# EAGLE design santiago (EAGLE 5.08)

## Sheet 1 of 3
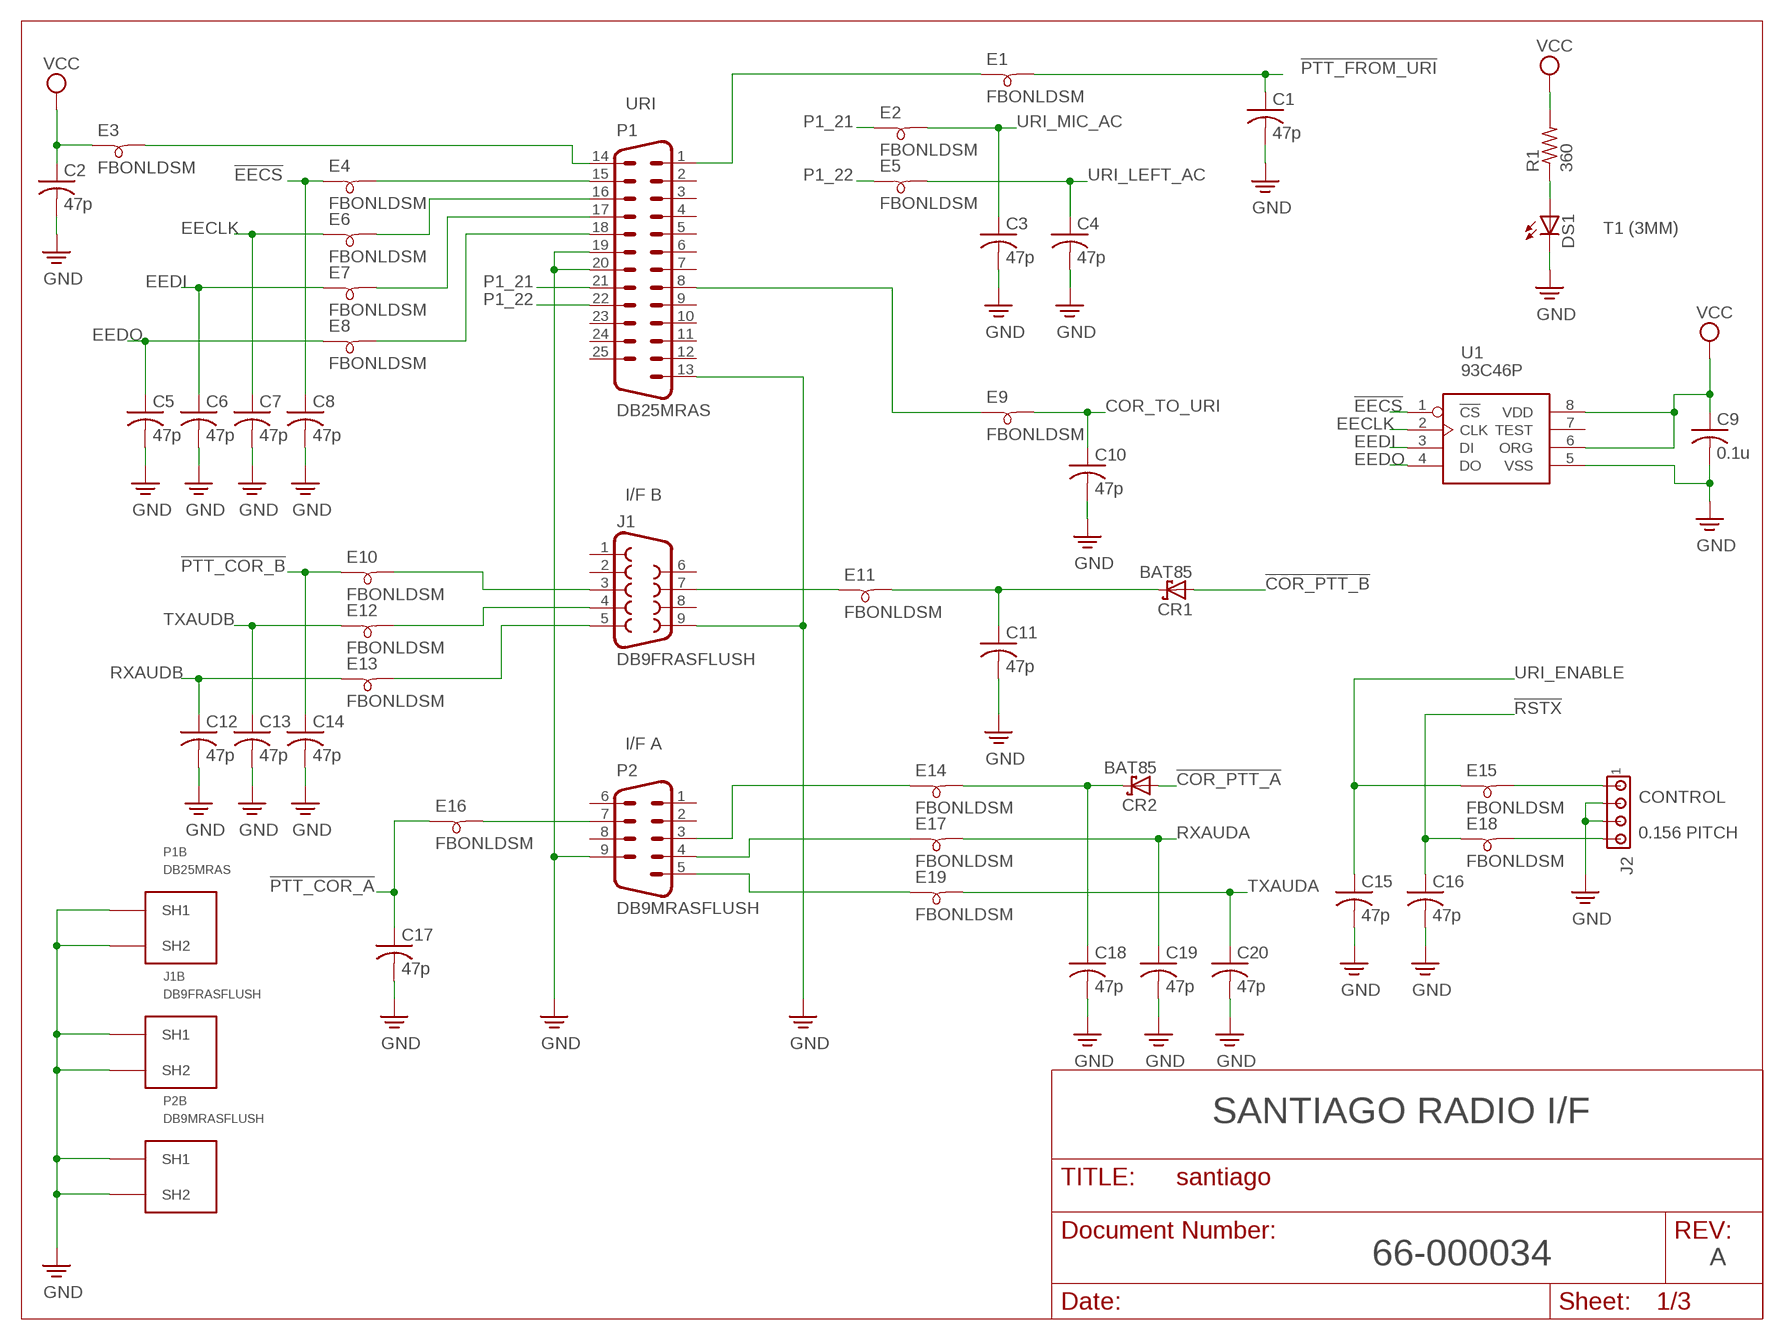
[diagram p0: schematic, sheet 1]

### Parts
C1  47p  C-US025-030X050  [C025-030X050]
C2  47p  C-US025-030X050  [C025-030X050]
C3  47p  C-US025-030X050  [C025-030X050]
C4  47p  C-US025-030X050  [C025-030X050]
C5  47p  C-US025-030X050  [C025-030X050]
C6  47p  C-US025-030X050  [C025-030X050]
C7  47p  C-US025-030X050  [C025-030X050]
C8  47p  C-US025-030X050  [C025-030X050]
C9  0.1u  C-US025-030X050  [C025-030X050]
C10  47p  C-US025-030X050  [C025-030X050]
C11  47p  C-US025-030X050  [C025-030X050]
C12  47p  C-US025-030X050  [C025-030X050]
C13  47p  C-US025-030X050  [C025-030X050]
C14  47p  C-US025-030X050  [C025-030X050]
C15  47p  C-US025-030X050  [C025-030X050]
C16  47p  C-US025-030X050  [C025-030X050]
C17  47p  C-US025-030X050  [C025-030X050]
C18  47p  C-US025-030X050  [C025-030X050]
C19  47p  C-US025-030X050  [C025-030X050]
C20  47p  C-US025-030X050  [C025-030X050]
CR1  BAT85  [DO34-7]
CR2  BAT85  [DO34-7]
DS1  LED3MM  [LED3MM]
E1  FBONLDSM  [FBONLEADSSMALL]
E2  FBONLDSM  [FBONLEADSSMALL]
E3  FBONLDSM  [FBONLEADSSMALL]
E4  FBONLDSM  [FBONLEADSSMALL]
E5  FBONLDSM  [FBONLEADSSMALL]
E6  FBONLDSM  [FBONLEADSSMALL]
E7  FBONLDSM  [FBONLEADSSMALL]
E8  FBONLDSM  [FBONLEADSSMALL]
E9  FBONLDSM  [FBONLEADSSMALL]
E10  FBONLDSM  [FBONLEADSSMALL]
E11  FBONLDSM  [FBONLEADSSMALL]
E12  FBONLDSM  [FBONLEADSSMALL]
E13  FBONLDSM  [FBONLEADSSMALL]
E14  FBONLDSM  [FBONLEADSSMALL]
E15  FBONLDSM  [FBONLEADSSMALL]
E16  FBONLDSM  [FBONLEADSSMALL]
E17  FBONLDSM  [FBONLEADSSMALL]
E18  FBONLDSM  [FBONLEADSSMALL]
E19  FBONLDSM  [FBONLEADSSMALL]
J1  DB9FRASFLUSH  [DSUB9F]
J2  CONN_MTA156_RA_4P  [1X4MTA156RA]
P1  DB25MRAS  [DSUB25M]
P2  DB9MRASFLUSH  [DSUB9M]
R1  360  R-US_0207/10  [0207/10]
U1  93C46P  [DIL08]

### Nets
!COR_PTT_A: CR2.A ; also sheet 3
!COR_PTT_B: CR1.A ; also sheet 3
!EECS: C8.1 E4.1 U1.1(!CS)
!PTT_COR_A: C17.1 E16.1 ; also sheet 3
!PTT_COR_B: C14.1 E10.1 ; also sheet 3
!PTT_FROM_URI: C1.1 E1.2 ; also sheet 3
!RSTX: C16.1 E18.1 ; also sheet 3
COR_TO_URI: C10.1 E9.2 ; also sheet 3
CORPTTB: C11.1 CR1.C E11.2
EECLK: C7.1 E6.1 U1.2(CLK)
EEDI: C6.1 E7.1 U1.3(DI)
EEDO: C5.1 E8.1 U1.4(DO)
GND: C1.2 C2.2 C3.2 C4.2 C5.2 C6.2 C7.2 C8.2 C9.2 C10.2 C11.2 C12.2 C13.2 C14.2 C15.2 C16.2 C17.2 C18.2 C19.2 C20.2 DS1.K(C) J1.9 J1.SHELL1(SH1) J1.SHELL2(SH2) J2.2 J2.3 P1.13 P1.19 P1.20 P1.SHELL1(SH1) P1.SHELL2(SH2) P2.9 P2.G1(SH1) P2.G2(SH2) U1.5(VSS) ; also sheet 2,3
N$8: E1.1 P1.1
N$9 [power]: E3.2 P1.14
N$11: E9.1 P1.8
N$12: E4.2 P1.15
N$13: E6.2 P1.16
N$14: E7.2 P1.17
N$15: E8.2 P1.18
N$16: E14.1 P2.3
N$17: E13.2 J1.5
N$18: E12.2 J1.4
N$19: E10.2 J1.3
N$20: E11.1 J1.7
N$21: E17.1 P2.4
N$22: E19.1 P2.5
N$25: C18.1 CR2.C E14.2
N$26: E16.2 P2.7
N$28: DS1.A R1.1
N$32: E18.2 J2.4
N$33: E15.2 J2.1
P1_21: E2.1 P1.21
P1_22: E5.1 P1.22
RXAUDA: C19.1 E17.2 ; also sheet 2
RXAUDB: C12.1 E13.1 ; also sheet 2
TXAUDA: C20.1 E19.2 ; also sheet 2
TXAUDB: C13.1 E12.1 ; also sheet 2
URI_ENABLE: C15.1 E15.1 ; also sheet 2,3
URI_LEFT_AC: C4.1 E5.2 ; also sheet 2
URI_MIC_AC: C3.1 E2.2 ; also sheet 2
VCC [power]: C2.1 C9.1 E3.1 R1.2 U1.6(ORG) U1.8(VDD) ; also sheet 2,3
Unconnected: J1.1 J1.2 J1.6 J1.8 P1.2 P1.3 P1.4 P1.5 P1.6 P1.7 P1.9 P1.10 P1.11 P1.12 P1.23 P1.24 P1.25 P2.1 P2.2 P2.6 P2.8 U1.7(TEST)

### Notes on the sheet
- URI
- T1 (3MM)
- I/F B
- I/F A
- CONTROL
- 0.156 PITCH
- SANTIAGO RADIO I/F
- 66-000034 | A

## Sheet 2 of 3
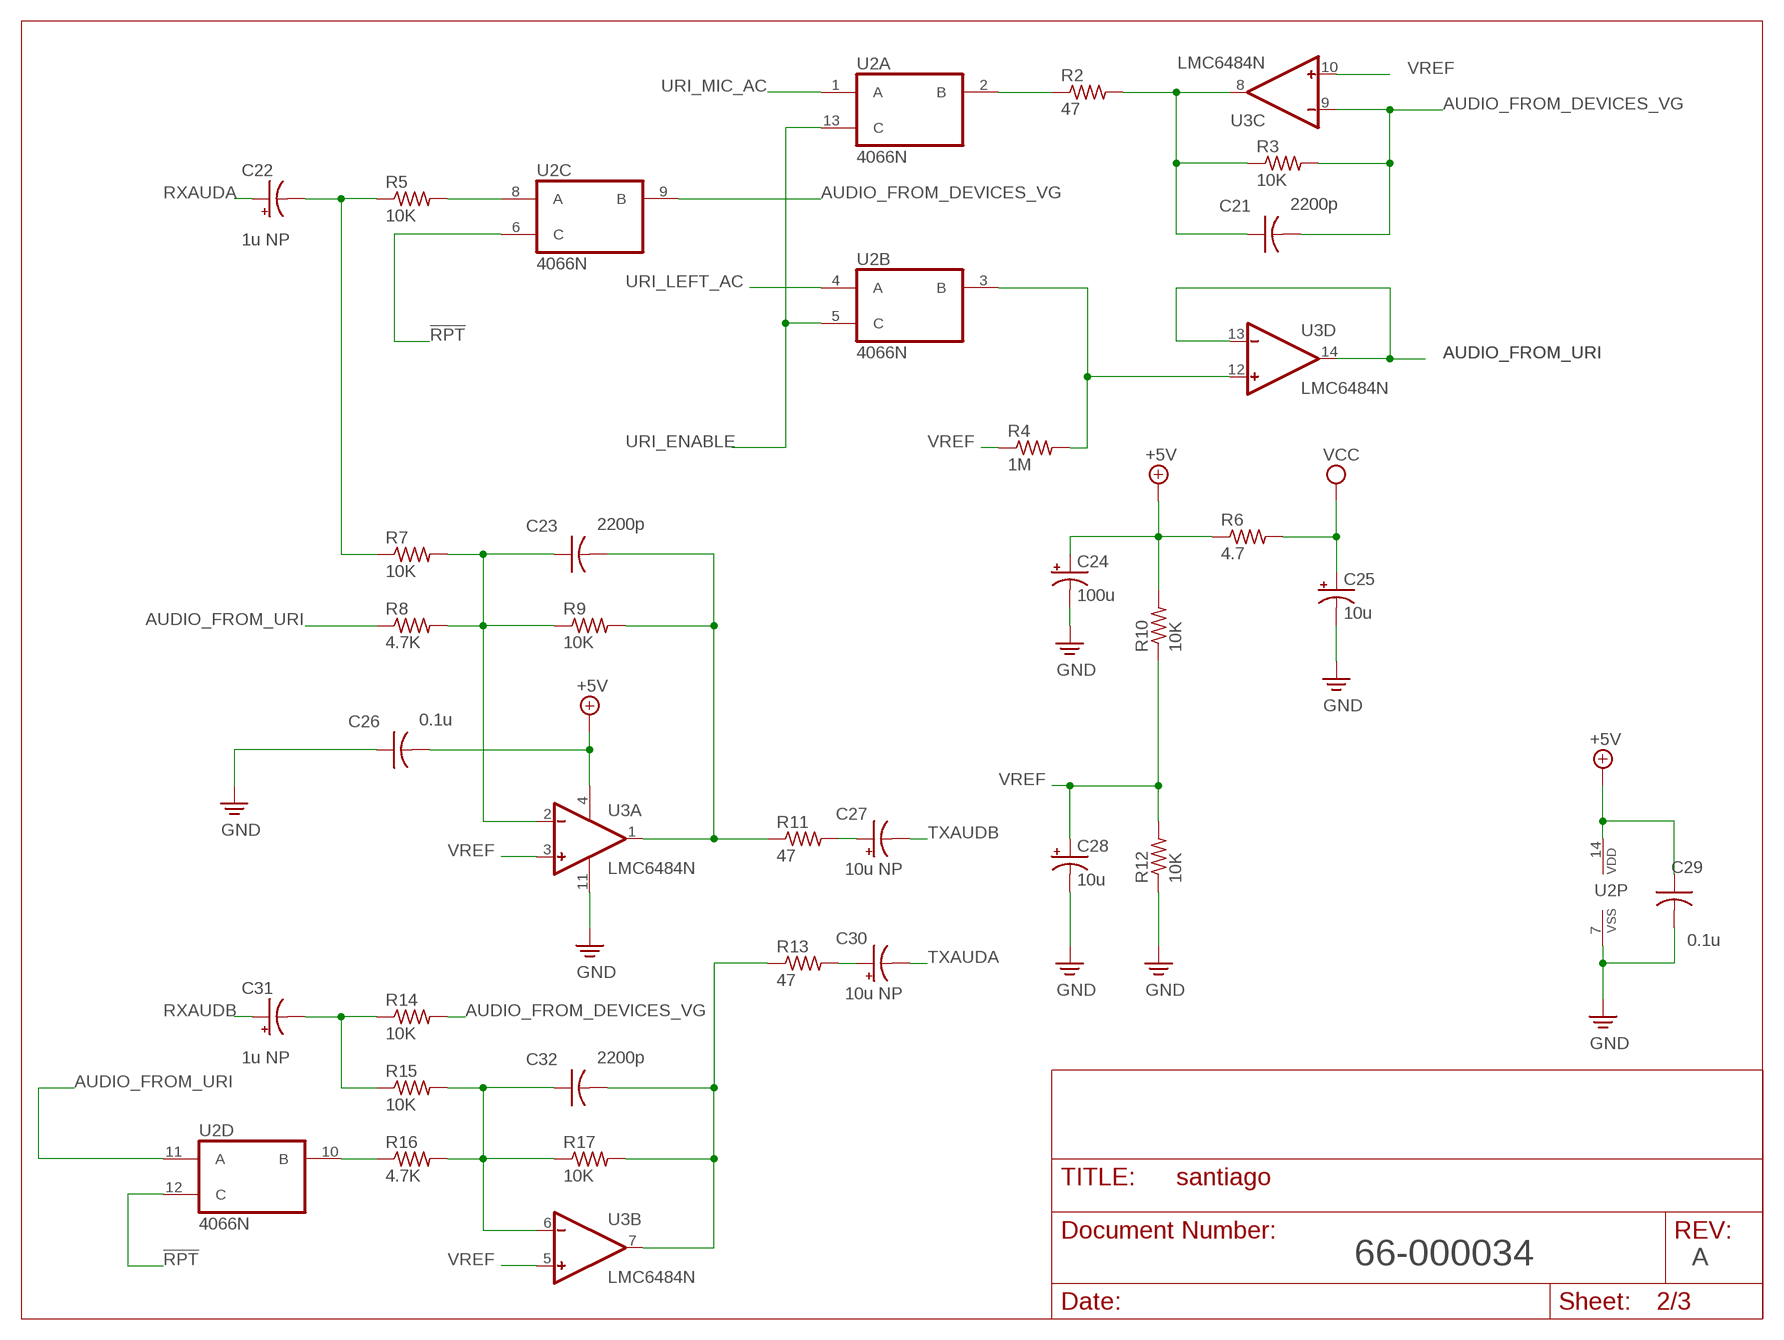
[diagram p1: schematic, sheet 2]

### Parts
C21  2200p  C-US025-030X050  [C025-030X050]
C22  1u NP  CPOL-USE2-5  [E2-5]
C23  2200p  C-US025-030X050  [C025-030X050]
C24  100u  CPOL-USE2.5-7  [E2,5-7]
C25  10u  CPOL-USE2-5  [E2-5]
C26  0.1u  C-US025-030X050  [C025-030X050]
C27  10u NP  CPOL-USE2.5-7  [E2,5-7]
C28  10u  CPOL-USE2-5  [E2-5]
C29  0.1u  C-US025-030X050  [C025-030X050]
C30  10u NP  CPOL-USE2.5-7  [E2,5-7]
C31  1u NP  CPOL-USE2-5  [E2-5]
C32  2200p  C-US025-030X050  [C025-030X050]
R2  47  R-US_0207/10  [0207/10]
R3  10K  R-US_0207/10  [0207/10]
R4  1M  R-US_0207/10  [0207/10]
R5  10K  R-US_0207/10  [0207/10]
R6  4.7  R-US_0207/10  [0207/10]
R7  10K  R-US_0207/10  [0207/10]
R8  4.7K  R-US_0207/10  [0207/10]
R9  10K  R-US_0207/10  [0207/10]
R10  10K  R-US_0207/10  [0207/10]
R11  47  R-US_0207/10  [0207/10]
R12  10K  R-US_0207/10  [0207/10]
R13  47  R-US_0207/10  [0207/10]
R14  10K  R-US_0207/10  [0207/10]
R15  10K  R-US_0207/10  [0207/10]
R16  4.7K  R-US_0207/10  [0207/10]
R17  10K  R-US_0207/10  [0207/10]
U2  4066N  [DIL14]
U3  LMC6484N  [DIL14]

### Nets
!RPT: U2.6(C:C) U2.12(D:C) ; also sheet 3
+5V [power]: C24.+ C26.2 C29.1 R6.1 R10.2 U2.14(P:VDD) U3.4(P:V+)
AUDIO_FROM_DEVICES_VG: C21.2 R3.2 R14.2 U2.9(C:B) U3.9(C:-IN)
AUDIO_FROM_URI: R8.1 U2.11(D:A) U3.13(D:-IN) U3.14(D:OUT)
GND: C24.- C25.- C26.1 C28.- C29.2 R12.1 U2.7(P:VSS) U3.11(P:V-) ; also sheet 1,3
N$1: R2.1 U2.2(A:B)
N$2: C21.1 R2.2 R3.1 U3.8(C:OUT)
N$3: C23.2 R9.2 R11.1 U3.1(A:OUT)
N$4: C23.1 R7.2 R8.2 R9.1 U3.2(A:-IN)
N$5: R4.2 U2.3(B:B) U3.12(D:+IN)
N$6: C32.2 R13.1 R17.2 U3.7(B:OUT)
N$7: C32.1 R15.2 R16.2 R17.1 U3.6(B:-IN)
N$10: C27.+ R11.2
N$23: C30.+ R13.2
N$24: C22.- R5.1 R7.1
N$27: C31.- R14.1 R15.1
N$34: R5.2 U2.8(C:A)
N$42: R16.1 U2.10(D:B)
RXAUDA: C22.+ ; also sheet 1
RXAUDB: C31.+ ; also sheet 1
TXAUDA: C30.- ; also sheet 1
TXAUDB: C27.- ; also sheet 1
URI_ENABLE: U2.5(B:C) U2.13(A:C) ; also sheet 1,3
URI_LEFT_AC: U2.4(B:A) ; also sheet 1
URI_MIC_AC: U2.1(A:A) ; also sheet 1
VCC [power]: C25.+ R6.2 ; also sheet 1,3
VREF: C28.+ R4.1 R10.1 R12.2 U3.3(A:+IN) U3.5(B:+IN) U3.10(C:+IN)

### Notes on the sheet
- 66-000034 | A

## Sheet 3 of 3
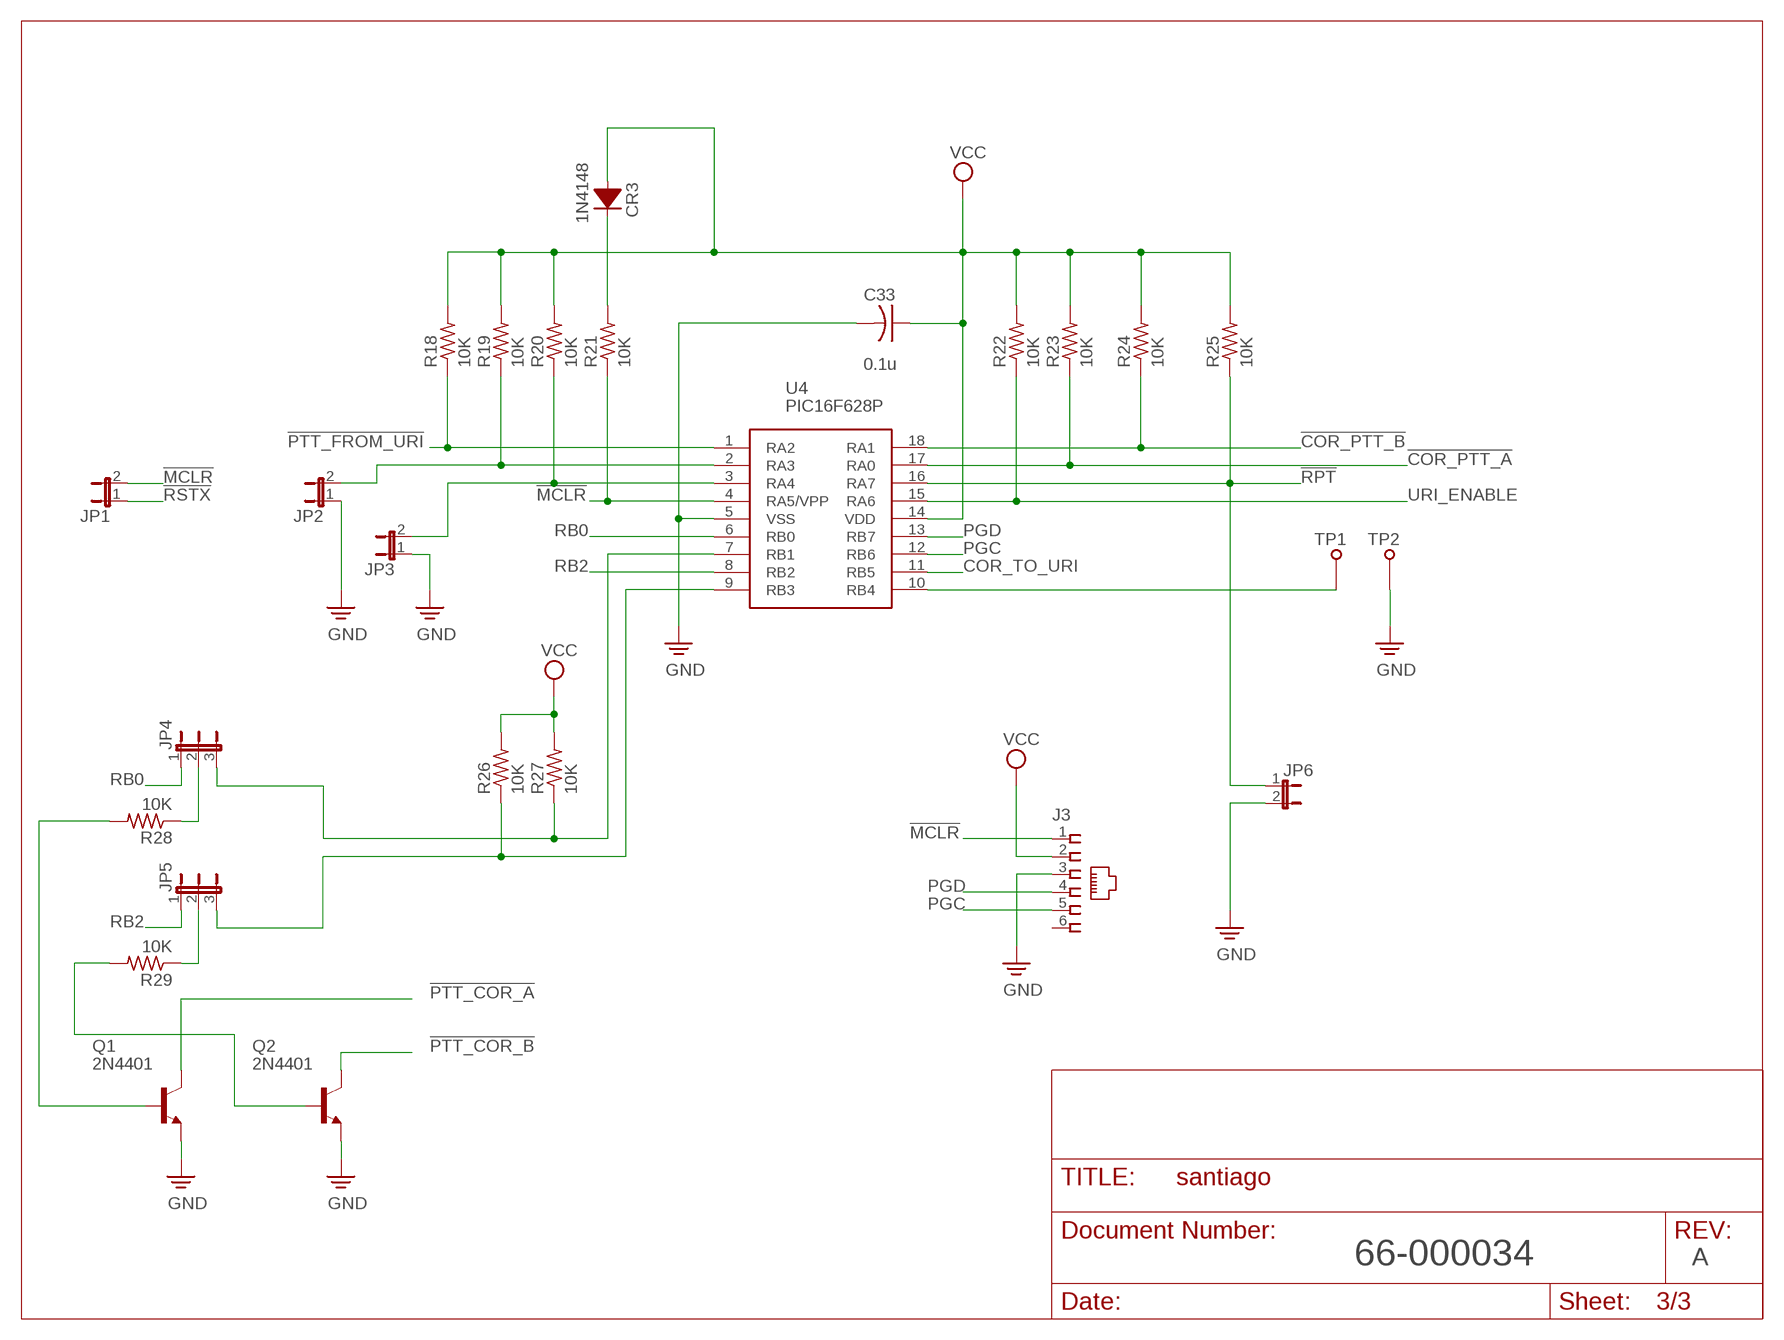
[diagram p2: schematic, sheet 3]

### Parts
C33  0.1u  C-US025-030X050  [C025-030X050]
CR3  1N4148  [DO35-10]
J3  520258-3  [520258-3]
JP1  JP1E  [JP1]
JP2  JP1E  [JP1]
JP3  JP1E  [JP1]
JP4  JP2E  [JP2]
JP5  JP2E  [JP2]
JP6  JP1E  [JP1]
Q1  2N4401  [TO92]
Q2  2N4401  [TO92]
R18  10K  R-US_0207/10  [0207/10]
R19  10K  R-US_0207/10  [0207/10]
R20  10K  R-US_0207/10  [0207/10]
R21  10K  R-US_0207/10  [0207/10]
R22  10K  R-US_0207/10  [0207/10]
R23  10K  R-US_0207/10  [0207/10]
R24  10K  R-US_0207/10  [0207/10]
R25  10K  R-US_0207/10  [0207/10]
R26  10K  R-US_0207/10  [0207/10]
R27  10K  R-US_0207/10  [0207/10]
R28  10K  R-US_0207/10  [0207/10]
R29  10K  R-US_0207/10  [0207/10]
TP1  TESTPINTPSQ025  [TESTPIN]
TP2  TESTPINTPSQ025  [TESTPIN]
U4  PIC16F628P  [DIL18]

### Nets
!COR_PTT_A: R23.1 U4.17(RA0) ; also sheet 1
!COR_PTT_B: R24.1 U4.18(RA1) ; also sheet 1
!MCLR: J3.1 JP1.2 R21.1 U4.4(RA5/VPP)
!PTT_COR_A: Q1.1(C) ; also sheet 1
!PTT_COR_B: Q2.1(C) ; also sheet 1
!PTT_FROM_URI: R18.1 U4.1(RA2) ; also sheet 1
!RPT: JP6.1 R25.1 U4.16(RA7) ; also sheet 2
!RSTX: JP1.1 ; also sheet 1
COR_TO_URI: U4.11(RB5) ; also sheet 1
GND: C33.2 J3.3 JP2.1 JP3.1 JP6.2 Q1.3(E) Q2.3(E) TP2.TP U4.5(VSS) ; also sheet 1,2
N$29: CR3.K R21.2
N$30: JP5.3 R26.1 U4.9(RB3)
N$31: JP4.3 R27.1 U4.7(RB1)
N$35: JP3.2 R20.1 U4.3(RA4)
N$36: JP2.2 R19.1 U4.2(RA3)
N$37: JP4.2 R28.1
N$38: JP5.2 R29.1
N$39: Q1.2(B) R28.2
N$40: Q2.2(B) R29.2
N$41: TP1.TP U4.10(RB4)
PGC: J3.5 U4.12(RB6)
PGD: J3.4 U4.13(RB7)
RB0: JP4.1 U4.6(RB0)
RB2: JP5.1 U4.8(RB2)
URI_ENABLE: R22.1 U4.15(RA6) ; also sheet 1,2
VCC [power]: C33.1 CR3.A J3.2 R18.2 R19.2 R20.2 R22.2 R23.2 R24.2 R25.2 R26.2 R27.2 U4.14(VDD) ; also sheet 1,2
Unconnected: J3.6

### Notes on the sheet
- 66-000034 | A

## Library data of the parts
C1-C21 C23 C26 C29 C32 C33 = rcl:C-US: CAPACITOR, American symbol
C22 C24 C25 C27 C28 C30 C31 = rcl:CPOL-US: POLARIZED CAPACITOR, American symbol
CR1 CR2 = custom:BAT85: BAT85 Schottky Diode 7mm DO-34
CR3 = qrp:1N4148: General Purpose Switching Diode
DS1 = led:LED: LED OSRAM: - CHIPLED LG R971, LG N971, LY N971, LG Q971, LY Q971, LO R971, LY R971 LH N974, LH R974 LS Q976, LO Q976, LY Q976 LO Q996 - Hyper CHIPLED LW Q18S LB Q993, LB Q99A, LB R99A - SideLED LS A670, LO A670, LY A670, LG A670, LP A670 LB A673, LV A673, LT A673, LW A673 LH A674 LY A675 LS A676, LA A676, LO A676, LY A676, LW A676 LS A679, LY A679, LG A679 - Hyper Micro SIDELED® LS Y876, LA Y876, LO Y876, LY Y876 LT Y87S - SmartLED LW L88C, LW L88S LB L89C, LB L89S, LG L890 LS L89K, LO L89K, LY L89K LS L896, LA L896, LO L896, LY L896 - TOPLED LS T670, LO T670, LY T670, LG T670, LP T670 LSG T670, LSP T670, LSY T670, LOP T670, LYG T670 LG T671, LOG T671, LSG T671 LB T673, LV T673, LT T673, LW T673 LH T674 LS T676, LA T676, LO T676, LY T676, LB T676, LH T676, LSB T676, LW T676 LB T67C, LV T67C, LT T67C, LS T67K, LO T67K, LY T67K, LW E67C LS E67B, LA E67B, LO E67B, LY E67B, LB E67C, LV E67C, LT E67C LW T67C LS T679, LY T679, LG T679 LS T770, LO T770, LY T770, LG T770, LP T770 LB T773, LV T773, LT T773, LW T773 LH T774 LS E675, LA E675, LY E675, LS T675 LS T776, LA T776, LO T776, LY T776, LB T776 LHGB T686 LT T68C, LB T68C - Hyper Mini TOPLED® LB M676 - Mini TOPLED Santana® LG M470 LS M47K, LO M47K, LY M47K Source: http://www.osram.convergy.de LUXEON: - LUMILED® LXK2-PW12-R00, LXK2-PW12-S00, LXK2-PW14-U00, LXK2-PW14-V00 LXK2-PM12-R00, LXK2-PM12-S00, LXK2-PM14-U00 LXK2-PE12-Q00, LXK2-PE12-R00, LXK2-PE12-S00, LXK2-PE14-T00, LXK2-PE14-U00 LXK2-PB12-K00, LXK2-PB12-L00, LXK2-PB12-M00, LXK2-PB14-N00, LXK2-PB14-P00, LXK2-PB14-Q00 LXK2-PR12-L00, LXK2-PR12-M00, LXK2-PR14-Q00, LXK2-PR14-R00 LXK2-PD12-Q00, LXK2-PD12-R00, LXK2-PD12-S00 LXK2-PH12-R00, LXK2-PH12-S00 LXK2-PL12-P00, LXK2-PL12-Q00, LXK2-PL12-R00 Source: www.luxeon.com KINGBRIGHT: KA-3528ASYC Source: www.kingbright.com
E1-E19 = custom:FBONLDSM
J1 = custom:DB9FRAS: DB9 Female Right Angle Connector 0.318
J2 = custom:CONN_MTA156_RA_4P: TYCO MTA .156 Right Angle 4 Pin
J3 = con-amp:520258-3: AMP connector
JP1-JP3 JP6 = jumper:JP1E: JUMPER
JP4 JP5 = jumper:JP2E: JUMPER
P1 = custom:DB25MRAS: DB25 Male Right Angle Short
P2 = custom:DB9MRAS: DB9 Male Right Angle 0.318
Q1 Q2 = custom:2N4401: NPN Transistor
R1 R18-R29 = rcl:R-US_: RESISTOR, American symbol
R2-R17 = resistor:R-US_: RESISTOR, American symbol
TP1 TP2 = custom:TESTPIN: Test pin assortment
U1 = custom:93C46: 93C46 1024 Bit EEPROM DIL08
U2 = 40xx:4066: Quad bilateral ANALOG SWITCH
U3 = custom:LMC6484: OP AMP
U4 = custom:PIC16F628: PIC16F628 DIL18

## Net classes
0 default: width 0.254 mm, drill 0.381 mm, clearance 0.254 mm
1 power: width 0.635 mm, drill 0.762 mm, clearance 0.254 mm

## Board
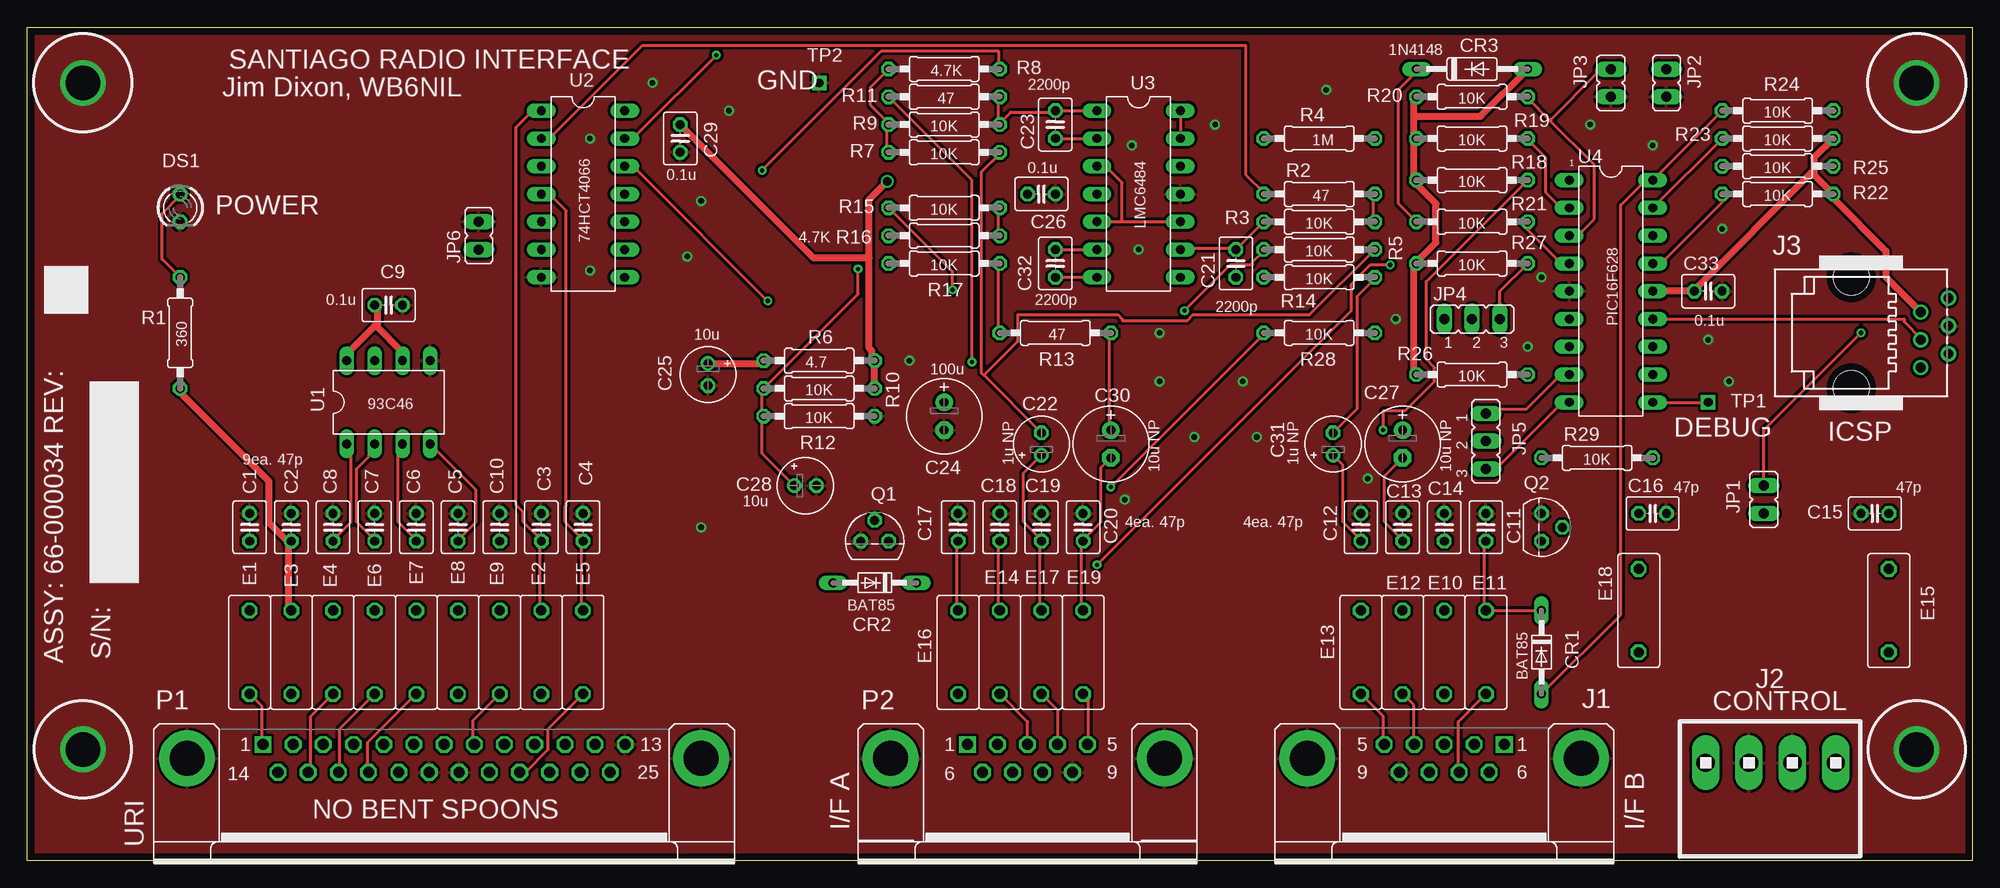
[diagram p3: board, top side]
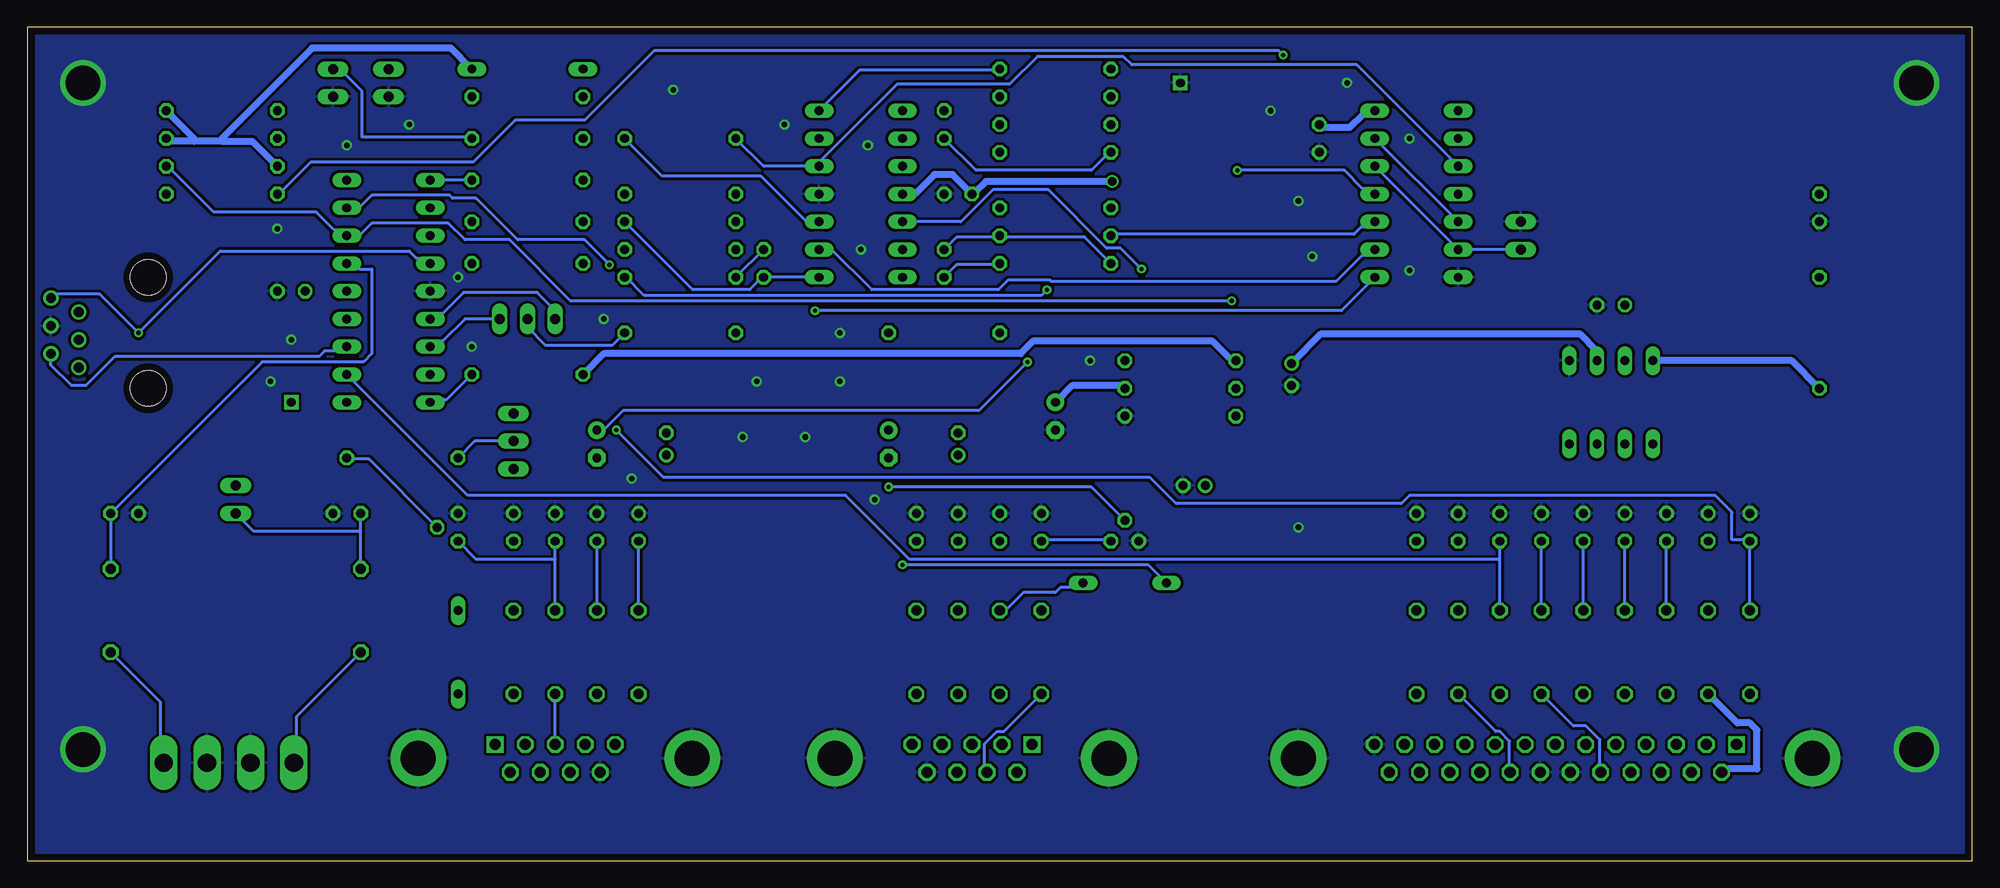
[diagram p4: board, bottom side, seen from below]

Size 177.8 x 76.2 mm. Coordinates in mm from the lower left corner, seen from the top.
Outline: 0,0 0,76.2 177.8,76.2 177.8,0 0,0
Copper layers (1*16): Top 0.035mm / dielectric 1.5mm / Bottom 0.035mm
Design rules "default *": minimum track width 10mil, minimum drill 15mil, track to track 10mil, track to pad 10mil, pad to pad 10mil, via to via 10mil, smd to smd 10mil, copper to edge 25mil, drill to drill 10mil, minimum pad ring 10mil, minimum via ring 8mil, stop-mask expansion 4mil, vias tented up to drill 0mil, thermal gap 10mil

### Footprints (pad centres in the part's own frame; a part is rotated, then mirrored left to right if it is on the bottom)
C025-030X050 = drill 0.813 octagon: 1 -1.27,0; 2 1.27,0
E2-5 = drill 0.813 pad 1.27 round: + -1.016,0 | drill 0.813 pad 1.27 octagon: - 1.016,0
E2,5-7 = drill 0.813 pad 1.6 round: + -1.27,0 | drill 0.813 pad 1.6 octagon: - 1.27,0
DO34-7 = drill 0.813 long: A 3.81,0; C -3.81,0
DO35-10 = drill 0.813 long: A 5.08,0; K -5.08,0
LED3MM = drill 0.813 octagon: A -1.27,0; K 1.27,0
FBONLEADSSMALL = drill 0.914 octagon: 1 -3.81,0; 2 3.81,0
DSUB9F = drill 1.016 square: 1 -5.486,0 | drill 1.016 octagon: 2 -2.743,0; 3 0,0; 4 2.743,0; 5 5.486,0; 6 -4.115,2.54; 7 -1.372,2.54; 8 1.372,2.54; 9 4.115,2.54 | drill 3.175 pad 5.08 round: SHELL1 -12.522,1.27; SHELL2 12.522,1.27
1X4MTA156RA = drill 1.676 long: 1 -5.944,0; 2 -1.981,0; 3 1.981,0; 4 5.944,0
520258-3 = drill 0.889 round: 1 -3.175,8.001; 2 -1.905,5.461; 3 -0.635,8.001; 4 0.635,5.461; 5 1.905,8.001; 6 3.175,5.461 | hole 3.251: -5.08,-0.889; 5.08,-0.889
JP1 = drill 0.914 long: 1 0,-1.27; 2 0,1.27
JP2 = drill 0.914 long: 1 -2.54,0; 2 0,0; 3 2.54,0
DSUB25M = drill 1.016 square: 1 -16.561,10.16 | drill 1.016 octagon: 2 -13.792,10.16; 3 -11.049,10.16; 4 -8.28,10.16; 5 -5.512,10.16; 6 -2.769,10.16; 7 0,10.16; 8 2.769,10.16; 9 5.512,10.16; 10 8.28,10.16; 11 11.049,10.16; 12 13.792,10.16; 13 16.561,10.16; 14 -15.189,7.62; 15 -12.421,7.62; 16 -9.652,7.62; 17 -6.909,7.62; 18 -4.14,7.62; 19 -1.372,7.62; 20 1.372,7.62; 21 4.14,7.62; 22 6.909,7.62; 23 9.652,7.62; 24 12.421,7.62; 25 15.189,7.62 | drill 3.175 pad 5.08 round: SHELL1 -23.495,8.89; SHELL2 23.495,8.89
DSUB9M = drill 1.016 square: 1 -5.486,0 | drill 1.016 octagon: 2 -2.743,0; 3 0,0; 4 2.743,0; 5 5.486,0; 6 -4.115,-2.54; 7 -1.372,-2.54; 8 1.372,-2.54; 9 4.115,-2.54 | drill 3.175 pad 5.08 round: G1 -12.522,-1.27; G2 12.522,-1.27
TO92 = drill 0.813 octagon: 1 1.27,0; 2 0,1.905; 3 -1.27,0
0207/10 = drill 0.813 octagon: 1 -5.08,0; 2 5.08,0
TESTPIN = drill 0.8 square: TP 0,0
DIL08 = drill 0.813 long: 1 -3.81,-3.81; 2 -1.27,-3.81; 3 1.27,-3.81; 4 3.81,-3.81; 5 3.81,3.81; 6 1.27,3.81; 7 -1.27,3.81; 8 -3.81,3.81
DIL14 = drill 0.813 long: 1 -7.62,-3.81; 2 -5.08,-3.81; 3 -2.54,-3.81; 4 0,-3.81; 5 2.54,-3.81; 6 5.08,-3.81; 7 7.62,-3.81; 8 7.62,3.81; 9 5.08,3.81; 10 2.54,3.81; 11 0,3.81; 12 -2.54,3.81; 13 -5.08,3.81; 14 -7.62,3.81
DIL18 = drill 0.813 long: 1 -10.16,-3.81; 2 -7.62,-3.81; 3 -5.08,-3.81; 4 -2.54,-3.81; 5 0,-3.81; 6 2.54,-3.81; 7 5.08,-3.81; 8 7.62,-3.81; 9 10.16,-3.81; 10 10.16,3.81; 11 7.62,3.81; 12 5.08,3.81; 13 2.54,3.81; 14 0,3.81; 15 -2.54,3.81; 16 -5.08,3.81; 17 -7.62,3.81; 18 -10.16,3.81

### Placement (x,y rotation side)
C1  20.32,30.48 90 top
C2  24.13,30.48 90 top
C3  46.99,30.48 90 top
C4  50.8,30.48 90 top
C5  39.37,30.48 90 top
C6  35.56,30.48 90 top
C7  31.75,30.48 90 top
C8  27.94,30.48 90 top
C9  33.02,50.8 0 top
C10  43.18,30.48 90 top
C11  133.35,30.48 90 top
C12  121.92,30.48 90 top
C13  125.73,30.48 90 top
C14  129.54,30.48 90 top
C15  168.91,31.75 180 top
C16  148.59,31.75 0 top
C17  85.09,30.48 90 top
C18  88.9,30.48 90 top
C19  92.71,30.48 90 top
C20  96.52,30.48 90 top
C21  110.49,54.61 90 top
C22  92.71,38.1 90 top
C23  93.98,67.31 90 top
C24  83.82,40.64 270 top
C25  62.23,44.45 270 top
C26  92.71,60.96 180 top
C27  125.73,38.1 270 top
C28  71.12,34.29 0 top
C29  59.69,66.04 270 top
C30  99.06,38.1 270 top
C31  119.38,38.1 90 top
C32  93.98,54.61 270 top
C33  153.67,52.07 0 top
CR1  138.43,19.05 270 top
CR2  77.47,25.4 180 top
CR3  132.08,72.39 0 top
DS1  13.97,59.69 270 top
E1  20.32,19.05 90 top
E2  46.99,19.05 90 top
E3  24.13,19.05 270 top
E4  27.94,19.05 270 top
E5  50.8,19.05 90 top
E6  31.75,19.05 270 top
E7  35.56,19.05 270 top
E8  39.37,19.05 270 top
E9  43.18,19.05 90 top
E10  129.54,19.05 270 top
E11  133.35,19.05 90 top
E12  125.73,19.05 270 top
E13  121.92,19.05 270 top
E14  88.9,19.05 90 top
E15  170.18,22.86 270 top
E16  85.09,19.05 270 top
E17  92.71,19.05 90 top
E18  147.32,22.86 270 top
E19  96.52,19.05 90 top
J1  129.54,10.62 180 top
J2  159.38,8.94 180 top
J3  167.64,48.26 270 top
JP1  158.75,33.02 0 top
JP2  149.86,71.12 0 top
JP3  144.78,71.12 0 top
JP4  132.08,49.53 0 top
JP5  133.35,38.35 270 top
JP6  41.27,57.15 0 top
P1  38.1,0.46 0 top
P2  91.44,10.62 0 top
Q1  77.47,29.21 0 top
Q2  138.43,30.48 270 top
R1  13.97,48.26 270 top
R2  118.11,60.96 0 top
R3  118.11,58.42 180 top
R4  118.11,66.04 180 top
R5  118.11,55.88 180 top
R6  72.39,45.72 180 top
R7  83.82,64.77 180 top
R8  83.82,72.39 180 top
R9  83.82,67.31 0 top
R10  72.39,43.18 0 top
R11  83.82,69.85 180 top
R12  72.39,40.64 180 top
R13  93.98,48.26 0 top
R14  118.11,53.34 180 top
R15  83.82,59.69 0 top
R16  83.82,57.15 0 top
R17  83.82,54.61 0 top
R18  132.08,62.23 180 top
R19  132.08,66.04 180 top
R20  132.08,69.85 180 top
R21  132.08,58.42 180 top
R22  160.02,60.96 0 top
R23  160.02,66.04 0 top
R24  160.02,68.58 0 top
R25  160.02,63.5 180 top
R26  132.08,44.45 180 top
R27  132.08,54.61 180 top
R28  118.11,48.26 180 top
R29  143.51,36.83 0 top
TP1  153.67,41.91 0 top
TP2  72.39,71.12 0 top
U1  33.02,41.91 0 top
U2  50.8,60.96 270 top
U3  101.6,60.96 270 top
U4  144.78,52.07 270 top

### Tracks (layer width: path | path; a pad name or v marks a point on that pad's centre or on a via)
!COR_PTT_A  (via drill 0.38)
  Top 0.254: v97.79,27.05 121.03,50.29 121.03,52.7 122.81,54.48 v124.59,54.48 | U4.17 R23.1
  Bottom 0.254: CR2.A 75.31,27.05 v97.79,27.05 | v124.59,54.48 126.87,56.77 132.97,56.77 136.78,60.58 138.94,60.58 139.19,60.83 146.3,60.83 147.45,59.69 U4.17
!COR_PTT_B
  Top 0.254: CR1.A 145.67,22.48 145.67,59.94 147.96,62.23 U4.18 R24.1
!EECS
  Top 0.254: U1.1 29.59,37.72 29.59,30.99 27.94,29.34 C8.1
  Bottom 0.254: E4.1 C8.1
!MCLR  (via drill 0.38)
  Top 0.254: U4.4 139.83,54.61 139.83,54.99 137.16,57.66 R21.1 | v167.64,48.26 158.75,39.37 JP1.2
  Bottom 0.254: J3.1 175.26,51.82 171.2,51.82 v167.64,48.26 167.64,48.39 167.51,48.39 160.15,55.75 142.88,55.75 142.24,55.12 141.48,55.12 U4.4
!PTT_COR_A
  Top 0.254: E16.1 84.96,22.99 84.96,29.08 C17.1
  Bottom 0.254: Q1.1 78.87,29.34 84.96,29.34 C17.1
!PTT_COR_B
  Bottom 0.254: E10.1 129.54,27.56 | 129.54,27.56 C14.1 | Q2.1 136.78,27.56 129.54,27.56
!PTT_FROM_URI  (via drill 0.38)
  Top 0.254: R18.1 127.89,52.96 127.89,45.85 128.65,45.09 128.65,43.81 125.98,41.15 123.95,41.15 v123.95,39.37
  Bottom 0.254: R18.1 U4.1 | E1.2 C1.1 20.45,29.34 21.97,29.34 21.97,31.88 23.5,33.4 51.44,33.4 52.2,32.64 72.77,32.64 75.18,35.05 119.63,35.05 v123.95,39.37
!RPT  (via drill 0.38)
  Top 0.254: U2.12 55.75,63.5 55.75,63.12 v67.69,51.18
  Bottom 0.254: JP6.1 U2.6 U2.12 | R25.1 164.97,63.5 160.78,59.31 151.38,59.31 149.73,57.66 149.1,57.66 U4.16 148.59,57.28 147.32,57.28 146.3,58.29 139.32,58.29 137.79,56.77 133.73,56.77 128.14,51.18 v67.69,51.18
!RSTX
  Bottom 0.254: E18.1 147.32,30.1 | 147.32,30.1 C16.1 | JP1.1 157.1,30.1 147.32,30.1
+5V  (via drill 0.76)
  Top 0.635: R10.2 R6.1 77.22,45.85 77.22,46.61 76.96,46.86 76.96,55.12 | C29.1 71.88,55.12 76.96,55.12 | v78.61,62.1 76.96,60.45 76.96,55.12
  Bottom 0.635: U3.4 96.65,60.96 94.87,62.74 93.22,62.74 C26.2 91.19,61.09 90.17,62.1 v78.61,62.1 | U2.14 54.86,68.33 55.63,68.33 56.9,67.06 59.31,67.06 59.56,67.31 C29.1 | C24.+ 82.3,43.43 77.85,43.43 77.6,43.18 R10.2
AUDIO_FROM_DEVICES_VG
  Top 0.254: R3.2 C21.2 110.49,56.01 105.41,56.01 U3.9
  Bottom 0.254: C21.2 R14.2 | U2.9 55.12,55.37 55.75,55.37 58.17,52.96 84.2,52.96 84.33,53.09 88.14,53.09 89.03,52.2 100.58,52.2 104.27,55.88 U3.9
AUDIO_FROM_URI  (via drill 0.38)
  Top 0.254: U3.14 U3.13 | v67.18,63.12 78.11,74.04 88.77,74.04 88.77,72.52 R8.1
  Bottom 0.254: U2.11 55.12,61.47 55.75,61.47 57.4,63.12 v67.18,63.12 | U3.14 101.73,72.26 89.03,72.26 R8.1
COR_TO_URI
  Bottom 0.254: E9.2 43.18,27.56 | 43.18,27.56 C10.1 | U4.11 137.54,33.4 103,33.4 97.16,27.56 43.18,27.56
CORPTTB
  Top 0.254: C11.1 133.22,29.08 133.22,22.99 E11.2 CR1.C
EECLK
  Top 0.254: U1.2 31.24,37.59 31.24,36.96 30.1,35.81 30.1,30.99 31.75,29.34 C7.1
  Bottom 0.254: E6.1 C7.1
EEDI
  Top 0.254: U1.3 33.91,37.72 33.91,30.99 35.56,29.34 C6.1
  Bottom 0.254: E7.1 C6.1
EEDO
  Top 0.254: U1.4 41.02,33.91 41.02,30.99 39.37,29.34 C5.1
  Bottom 0.254: E8.1 C5.1
GND  (via drill 0.51, 3.17)
  other vias: 5.08,10.16 5.08,71.12 172.72,71.12 172.72,10.16 80.64,45.72 138.43,53.34 125.09,49.53 137.16,46.99 153.67,47.62 155.57,43.81 154.94,57.78 148.59,65.41 142.88,67.31 118.75,70.48 103.5,43.81 103.5,48.26 106.68,38.73 111.12,43.81 112.39,38.73 100.33,33.02 122.56,34.92 60.33,55.24 61.59,60.33 64.14,68.58 57.15,71.12 51.44,66.04 51.44,53.98 100.97,65.41 101.6,55.88 108.58,67.31 61.59,30.48
  pour Top: 0.64,75.56 177.16,75.56 177.16,0.64 0.64,0.64
  pour Bottom: 0.64,75.56 177.16,75.56 177.16,0.64 0.64,0.64
N$1
  Top 0.254: U2.2 48.13,66.04 48.13,66.42 56.26,74.55 111.38,74.55 111.38,62.74 113.03,61.09 R2.1
N$2
  Top 0.254: R3.1 123.06,58.55 123.06,60.83 R2.2
  Bottom 0.254: U3.8 C21.1 110.62,53.34 111.76,52.2 116.97,52.2 R3.1
N$3
  Top 0.254: R11.1 88.77,69.72 88.77,67.44 R9.2 88.9,67.44 89.92,68.45 93.98,68.45 C23.2 U3.1
N$4
  Top 0.254: C23.1 U3.2 | R7.2 78.61,64.9 78.61,67.18 R9.1 78.61,67.31 78.61,67.56 77.09,69.09 77.09,70.74 R8.2
  Bottom 0.254: C23.1 91.06,63.12 80.52,63.12 78.87,64.77 R7.2
N$5
  Bottom 0.254: U2.3 56.26,72.77 76.83,72.77 77.6,73.53 85.47,73.53 88.01,70.99 98.3,70.99 105.41,63.88 U3.12 110.49,63.5 R4.2
N$6
  Top 0.254: C32.2 U3.7 | R13.1 88.77,48.39 88.77,54.48 R17.2
  Bottom 0.254: C32.2 92.84,54.48 89.03,54.48 R17.2
N$7
  Top 0.254: C32.1 U3.6 | R15.2 88.77,59.56 88.77,57.28 R16.2
  Bottom 0.254: R17.1 81.15,57.02 88.77,57.02 R16.2 88.9,57.02 92.84,57.02 C32.1
N$8
  Top 0.254: E1.1 21.46,14.1 21.46,10.67 P1.1
N$9
  Bottom 0.635: E3.2 21.46,12.57 20.32,12.57 19.68,11.94 19.68,8.38 22.35,8.38 22.61,8.13 22.86,8.13 P1.14
N$10  (via drill 0.38)
  Top 0.254: R11.2 86.36,62.23 v86.36,45.59
  Bottom 0.254: v86.36,45.59 90.81,41.15 123.32,41.15 125.09,39.37 C27.+
N$11
  Top 0.254: E9.1 40.77,12.83 40.77,10.67 P1.8
N$12
  Top 0.254: E4.2 25.91,13.21 25.91,8.26 25.78,8.13 P1.15
N$13
  Top 0.254: E6.2 28.57,12.06 28.57,8.26 28.45,8.13 P1.16
N$14
  Top 0.254: E7.2 31.11,10.79 31.11,8.13 P1.17
N$15
  Bottom 0.254: E8.2 36.45,12.32 35.31,12.32 34.04,11.05 34.04,8.13 P1.18
N$16
  Top 0.254: E14.1 91.44,12.7 P2.3
N$17
  Top 0.254: E13.2 123.95,13.21 123.95,10.67 J1.5
N$18
  Top 0.254: E12.2 126.75,14.22 126.75,10.67 J1.4
N$19
  Bottom 0.254: J1.3 E10.2
N$20
  Top 0.254: E11.1 130.81,12.7 130.81,8.13 J1.7
N$21
  Top 0.254: E17.1 94.23,13.72 94.23,10.67 P2.4
N$22
  Top 0.254: E19.1 97.03,14.73 97.03,10.67 P2.5
N$23
  Top 0.254: R13.2 98.93,48.13 98.93,39.5 C30.+
N$24
  Top 0.254: 87.44,44.39 87.25,44.58 87.25,62.99 88.9,64.64 R7.1 | C22.- 87.44,44.39 | R5.1 117.22,49.91 106.55,49.91 106.05,49.4 100.08,49.4 100.08,49.53 99.69,49.91 90.55,49.91 90.55,47.5 87.44,44.39
N$25
  Top 0.254: C18.1 88.77,29.08 88.77,22.99 E14.2
  Bottom 0.254: CR2.C 81.66,25.02 83.31,25.02 83.82,24.51 86.74,24.51 88.39,22.86 E14.2
N$26
  Bottom 0.254: E16.2 88.52,11.81 89.15,11.81 90.3,10.67 90.3,8.13 90.17,8.13 P2.7
N$27  (via drill 0.38)
  Top 0.254: R15.1 84.58,53.85 v84.58,52.2 | C31.- 121.54,41.27 121.54,51.56 123.19,53.21 R14.1
  Bottom 0.254: v84.58,52.2 85.09,51.69 121.41,51.69 123.06,53.34 R14.1
N$28
  Top 0.254: R1.1 12.32,54.99 12.32,59.18 13.97,60.83 DS1.A
N$29
  Top 0.254: R21.2 125.35,60.07 125.35,70.48 127,72.14 CR3.K
N$30
  Top 0.254: JP5.3 134.62,35.81 134.62,36.2 140.34,41.91 U4.9
  Bottom 0.254: R26.1 139.45,42.16 139.7,42.16 139.95,41.91 U4.9
N$31
  Top 0.254: R27.1 134.62,52.07 JP4.3
  Bottom 0.254: U4.7 140.46,47.5 139.83,47.5 137.79,49.53 JP4.3
N$32
  Bottom 0.254: E18.2 153.16,13.21 153.16,9.02 153.42,9.02 J2.4
N$33
  Bottom 0.254: E15.2 165.61,14.48 165.61,9.02 165.35,9.02 J2.1
N$34  (via drill 0.38)
  Top 0.254: v105.79,50.29 109.98,54.48 112.01,54.48 112.01,54.74 113.03,55.75 R5.2
  Bottom 0.254: U2.8 57.66,50.29 v105.79,50.29
N$35
  Top 0.254: U4.3 142.11,57.15 142.11,57.53 143.26,58.67 143.26,63.63 139.26,67.63 | 139.26,67.63 137.16,69.72 R20.1 | JP3.2 143.51,72.39 143.51,72.01 139.32,67.82 139.32,67.69 139.26,67.63
N$36
  Top 0.254: U4.2 139.83,59.69 139.83,60.07 138.81,61.09 138.81,64.26 137.16,65.91 R19.1
  Bottom 0.254: JP2.2 149.35,71.88 148.72,71.88 147.19,70.36 147.19,66.17 137.29,66.17 R19.1
N$37
  Bottom 0.254: R28.1 124.33,47.12 130.43,47.12 132.08,48.77 JP4.2
N$38
  Bottom 0.254: R29.1 136.91,38.35 JP5.2
N$39  (via drill 0.38)
  Top 0.254: v99.06,34.16 113.03,48.13 R28.2
  Bottom 0.254: Q1.2 80.52,34.16 v99.06,34.16
N$40
  Bottom 0.254: Q2.2 146.56,36.7 148.46,36.7 R29.2
N$41
  Top 0.254: U4.10 TP1.TP
N$42
  Bottom 0.254: U2.10 55.12,57.91 55.88,57.91 56.52,57.28 78.61,57.28 R16.1
P1_21
  Bottom 0.254: E2.1 43.56,11.81 43.18,11.81 42.29,10.92 42.29,8.13 P1.21
P1_22
  Top 0.254: E5.1 47.62,12.06 47.62,10.16 45.59,8.13 45.09,8.13 P1.22
PGC
  Bottom 0.254: U4.12 148.97,46.61 150.62,46.61 151.13,46.1 169.8,46.1 172.47,43.43 173.74,43.43 175.64,45.34 J3.5
PGD
  Top 0.254: U4.13 171.58,49.53 171.58,49.28 173.1,47.75 J3.4
RB0
  Bottom 0.254: U4.6 140.46,50.04 139.83,50.04 137.92,51.94 131.19,51.94 129.54,50.29 JP4.1
RB2
  Top 0.254: U4.8 139.83,44.45 139.83,44.07 137.03,41.27 133.35,41.27 JP5.1
RXAUDA
  Top 0.254: E17.2 92.58,22.99 92.58,29.08 C19.1 92.58,29.21 92.58,29.46 91.06,30.99 91.06,35.43 C22.+
RXAUDB
  Top 0.254: C31.+ 120.27,36.2 120.27,30.99 121.92,29.34 C12.1
  Bottom 0.254: E13.1 C12.1
TXAUDA
  Top 0.254: E19.2 96.39,22.99 96.39,29.08 C20.1 96.52,29.34 98.17,30.99 98.17,35.94 C30.-
TXAUDB
  Top 0.254: C27.- 124.08,35.18 124.08,30.99 125.73,29.34 C13.1
  Bottom 0.254: E12.1 C13.1
URI_ENABLE  (via drill 0.38)
  Top 0.254: U4.15 149.73,54.61 149.73,54.99 154.94,60.2 R22.1 | U2.13 55.75,66.04 55.75,66.42 v62.99,73.66
  Bottom 0.254: U2.5 U2.13 | E15.1 C15.1 156.34,45.59 147.07,45.59 146.3,46.35 146.3,54.1 147.45,54.1 147.96,54.61 U4.15 | v62.99,73.66 63.37,74.04 120.52,74.04 126.87,67.69 133.22,67.69 137.03,63.88 151.89,63.88 154.81,60.96 R22.1
URI_LEFT_AC
  Top 0.254: E5.2 50.67,22.99 50.67,29.08 C4.1 50.67,29.21 50.67,29.46 49.15,30.99 49.15,32.38 49.28,32.51 49.28,59.44 48.13,60.58 48.13,60.96 U2.4
URI_MIC_AC
  Top 0.254: E2.2 46.86,22.99 46.86,29.08 C3.1 46.86,29.21 46.86,29.46 45.34,30.99 45.34,31.88 44.7,32.51 44.7,67.06 45.85,68.2 45.85,68.58 U2.1
VCC
  Top 0.635: R26.2 126.75,44.7 126.75,54.23 127,54.48 R27.2 127.13,54.86 128.78,56.52 128.78,60.07 127,61.85 R18.2 126.75,62.48 126.75,65.66 127,65.91 R19.2 126.75,66.17 126.75,68.07 | R20.2 126.75,69.6 126.75,68.07 | CR3.A 132.84,68.07 126.75,68.07 | U4.14 C33.1 152.53,52.32 163.07,62.87 163.32,62.74 | 163.32,62.74 R22.2 165.1,60.58 169.93,55.75 169.93,53.34 J3.2 | 163.32,62.74 163.32,64.26 R23.2 | E3.1 24.13,23.11 23.88,23.37 23.88,28.96 C2.1 23.75,29.21 22.1,30.86 22.1,34.67 13.97,42.8 R1.2 | C25.+ 67.31,45.47 R6.2 | U1.6 34.04,45.97 34.04,46.74 32,48.77 | 32,48.77 32,50.42 31.75,50.67 C9.1 | U1.8 29.46,45.97 29.46,46.61 31.75,48.9 32,48.77
  Bottom 0.635: R25.2 157.23,65.79 160.02,65.79 | 162.56,65.79 164.72,65.79 164.97,66.04 R23.2 | 160.02,65.79 162.56,65.79 | R24.2 162.56,66.04 162.56,65.79 | CR3.A 139.06,74.3 151.76,74.3 160.02,66.04 160.02,65.79 | R1.2 16.51,45.72 U1.8 | C25.+ 59.56,48.13 35.81,48.13 34.29,46.61 U1.6 | R26.2 125.09,46.35 87,46.35 85.85,47.5 69.47,47.5 67.69,45.72 R6.2
VREF  (via drill 0.38)
  Top 0.254: C28.+ 67.18,37.21 67.18,40.64 R12.2 67.18,40.77 67.18,43.05 R10.1 75.95,51.82 v75.95,54.1 | 100.08,58.42 U3.10 | U3.5 100.08,58.42 | U3.3 98.93,63.5 98.93,63.12 100.08,61.98 100.08,58.42
  Bottom 0.254: R4.1 119.76,62.61 110.74,62.61 106.55,58.42 U3.10 | v75.95,54.1 77.85,56.01 79.12,56.01 84.45,61.34 89.53,61.34 92.46,58.42 U3.5

### Text on the board
tPlace: 1N4148 | SANTIAGO RADIO INTERFACE | 4.7K | Jim Dixon, WB6NIL | GND | 2200p | 47 | 10K | 10K | 10K | 1M | 10K | 10K | 10K | 0.1u | 10K | 0.1u | 10K | 47 | 10K | POWER | 10K | LMC6484 | 10K | 10K | 74HCT4066 | 4.7K | 10K | 10K | 10K | 10K | 0.1u | 2200p | 2200p | PIC16F628 | 0.1u | 10u | 47 | 10K | 360 | 4.7 | 100u | 10K | 10K | 93C46 | 10K | DEBUG | ICSP | 9ea. 47p | 1u NP | 10u NP | 1u NP | 10u NP | 10K | 47p | 47p | 10u | 4ea. 47p | 4ea. 47p | BAT85 | ASSY: 66-000034 REV: | S/N: | BAT85 | CONTROL | NO BENT SPOONS | I/F A | I/F B | URI
bRestrict: A/W: 66-100034 Rev A